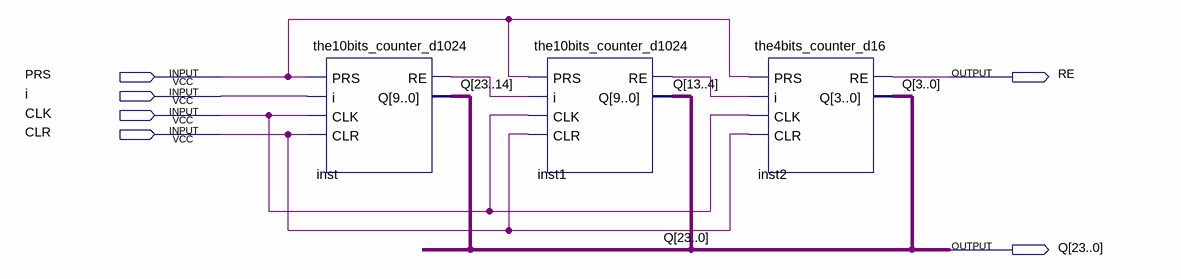
[diagram p0: schematic sheet]
// Quartus schematic the24bits_counter_d16777216.bdf as structural Verilog: 3 symbols, 6 pins
module the24bits_counter_d16777216 (
  input  PRS,
  input  i,
  input  CLK,
  input  CLR,
  output RE,
  output [23:0] Q
);

  wire inst1_re, inst_re;

  the10bits_counter_d1024 inst (.PRS(PRS), .i(i), .CLK(CLK), .CLR(CLR), .RE(inst_re), .Q(Q[23:14]));
  the10bits_counter_d1024 inst1 (.PRS(PRS), .i(inst_re), .CLK(CLK), .CLR(CLR), .RE(inst1_re), .Q(Q[13:4]));
  the4bits_counter_d16 inst2 (.PRS(PRS), .i(inst1_re), .CLK(CLK), .CLR(CLR), .RE(RE), .Q(Q[3:0]));
endmodule
